# EAGLE design R&N Motor Controller (EAGLE 8.6.0)
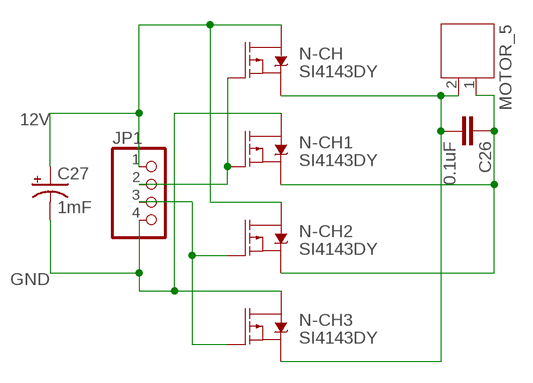
[diagram p0: schematic, sheet 1]

## Parts
C26  0.1uF  0.1UF-0603-25V-(+80/-20%)  [0603]
C27  1mF  1000UF-RADIAL-5MM-25V-20%  [CPOL-RADIAL-5MM-10MM]
JP1  PINHD-1X4  [1X04]
MOTOR_5  JST-PH2  [JST-PH2]
N-CH  SI4143DY  [SO-8]
N-CH1  SI4143DY  [SO-8]
N-CH2  SI4143DY  [SO-8]
N-CH3  SI4143DY  [SO-8]

## Nets
12V: C27.+ JP1.1 N-CH2.5(D) N-CH2.6(D) N-CH2.7(D) N-CH2.8(D) N-CH.5(D) N-CH.6(D) N-CH.7(D) N-CH.8(D)
GND: C27.- JP1.4 N-CH1.5(D) N-CH1.6(D) N-CH1.7(D) N-CH1.8(D) N-CH3.5(D) N-CH3.6(D) N-CH3.7(D) N-CH3.8(D)
N$9: C26.1 MOTOR_5.1 N-CH1.1(S) N-CH1.2(S) N-CH1.3(S) N-CH2.1(S) N-CH2.2(S) N-CH2.3(S)
N$10: C26.2 MOTOR_5.2 N-CH3.1(S) N-CH3.2(S) N-CH3.3(S) N-CH.1(S) N-CH.2(S) N-CH.3(S)
PWM_INA: JP1.2 N-CH1.4(G) N-CH.4(G)
PWM_INB: JP1.3 N-CH2.4(G) N-CH3.4(G)

## Library data of the parts
C26 = SparkFun-Capacitors:0.1UF: 0.1µF ceramic capacitors A capacitor is a passive two-terminal electrical component used to store electrical energy temporarily in an electric field.; PROD_ID: CAP-00810
C27 = SparkFun-Capacitors:1000UF: 1,000µF/1mF ceramic capacitors A capacitor is a passive two-terminal electrical component used to store electrical energy temporarily in an electric field. CAP-08070; PROD_ID: CAP-09538
JP1 = PinHead+:PINHD-1X4: PIN HEADER
MOTOR_5 = jst-ph:JST-PH2
N-CH N-CH1-N-CH3 = MOSFET:SI4143DY: MOSFET P-CHANNEL 30V 25.3A 8SO Digikey <https://www.digikey.com.au/product-detail/en/vishay-siliconix/SI4143DY-T1-GE3/SI4143DY-T1-GE3CT-ND/6834487>

## Board
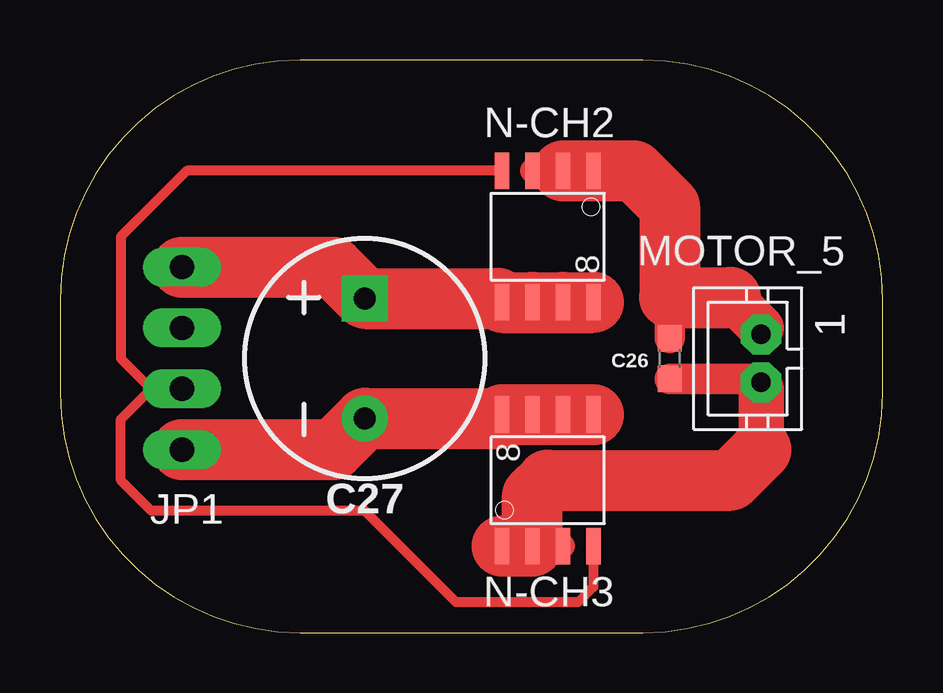
[diagram p1: board, top side]
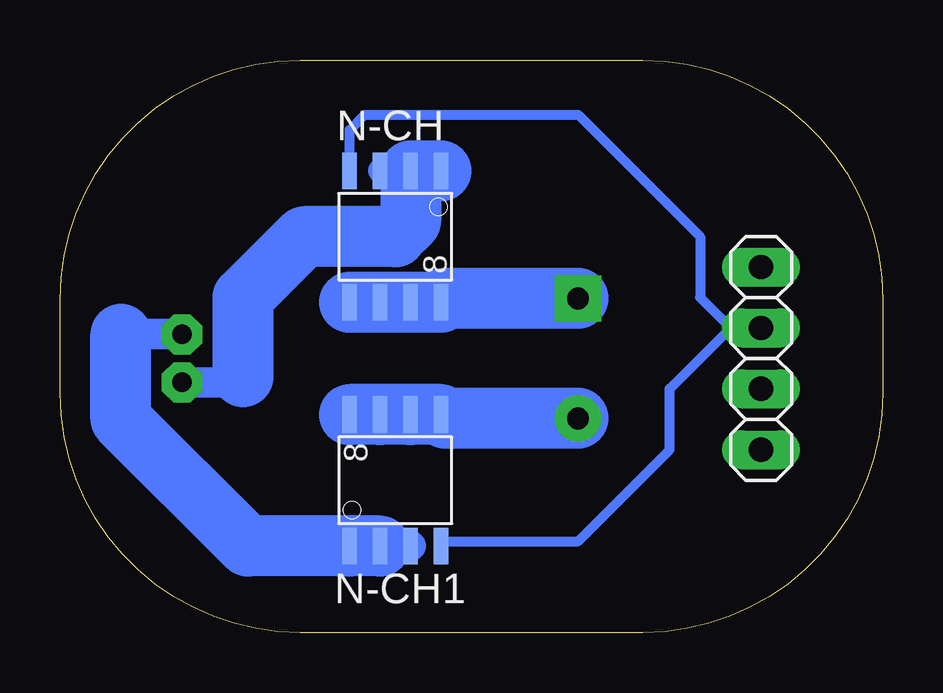
[diagram p2: board, bottom side, seen from below]

Size 34.29 x 23.88 mm. Coordinates in mm from the lower left corner, seen from the top.
Outline: 0,13.88 0,10 arc90 10,0 24.29,0 arc90 34.29,10 34.29,13.88 arc90 24.29,23.88 10,23.88 arc90 0,13.88
Copper layers (1*16): Top 0.035mm / dielectric 1.5mm / Bottom 0.035mm
Design rules "SparkFun": minimum track width 8mil, minimum drill 20mil, track to track 8mil, track to pad 8mil, pad to pad 8mil, via to via 8mil, smd to smd 8mil, copper to edge 10mil, drill to drill 8mil, minimum pad ring 12mil, minimum via ring 10mil, stop-mask expansion 4mil, vias tented up to drill 25mil, thermal gap 10mil

### Footprints (pad centres in the part's own frame; a part is rotated, then mirrored left to right if it is on the bottom)
0603 = smd 1.1 x 1: 1 -0.85,0; 2 0.85,0
CPOL-RADIAL-5MM-10MM = drill 0.9 pad 1.93 square: + 2.5,0 | drill 0.9 pad 1.93: - -2.5,0
1X04 = drill 1.016 long: 1 -3.81,0; 2 -1.27,0; 3 1.27,0; 4 3.81,0
JST-PH2 = drill 0.813 pad 1.676 octagon: 1 1,0; 2 -1,0
SO-8 = smd 1.524 x 0.61: 1 -2.743,1.905; 2 -2.743,0.635; 3 -2.743,-0.635; 4 -2.743,-1.905; 5 2.743,-1.905; 6 2.743,-0.635; 7 2.743,0.635; 8 2.743,1.905

### Placement (x,y rotation side)
C26  25.4,11.43 270 top
C27  12.7,11.43 90 top
JP1  5.08,11.43 270 bottom
MOTOR_5  29.21,11.43 90 top
N-CH  20.32,16.51 270 bottom
N-CH1  20.32,6.35 90 bottom
N-CH2  20.32,16.51 270 top
N-CH3  20.32,6.35 90 top

### Tracks (layer width: path | path; a pad name or v marks a point on that pad's centre or on a via)
12V
  Top 2.54: JP1.1 11.39,15.24 C27.+ 18.25,13.93 N-CH2.5 N-CH2.6 N-CH2.7 N-CH2.8
  Bottom 2.54: C27.+ 18.25,13.93 N-CH2.5 N-CH2.6 N-CH2.7 N-CH2.8
GND
  Top 2.54: N-CH1.8 N-CH1.7 N-CH1.6 N-CH1.5 18.25,8.93 C27.- 11.39,7.62 JP1.4
  Bottom 2.54: C27.- 18.25,8.93 N-CH1.5 N-CH1.6 N-CH1.7 N-CH1.8
N$9
  Top 1.016: N-CH2.3 N-CH2.2
  Top 1.27: 29.21,12.7 MOTOR_5.1 | 25.4,13.97 C26.1
  Top 1.905: 27.94,13.97 29.21,12.7
  Top 2.54: N-CH2.2 N-CH2.1 23.93,19.25 25.4,17.78 25.4,13.97 27.94,13.97
  Bottom 1.27: N-CH1.3 N-CH1.2 | 31.75,12.45 29.23,12.45 MOTOR_5.1
  Bottom 2.54: N-CH1.2 N-CH1.1 26.47,3.61 31.75,8.89 31.75,12.45
N$10
  Top 0.406: 29.21,8.89 arc-45 29.06,9.25 29.06,10.58
  Top 1.016: N-CH3.3 20.75,3.81 19.89,3.81 N-CH3.2
  Top 1.27: C26.2 29.06,10.58 MOTOR_5.2
  Top 1.905: 29.21,7.62 29.21,8.89 29.21,10.16
  Top 2.54: N-CH3.1 N-CH3.2 19.68,5.71 20.32,6.35 27.94,6.35 29.21,7.62
  Bottom 1.016: N-CH.3 N-CH.2
  Bottom 1.27: 26.67,10.67 26.91,10.43 MOTOR_5.2
  Bottom 2.54: N-CH.1 N-CH.2 19.68,17.14 20.32,16.51 24.13,16.51 26.67,13.97 26.67,10.67
PWM_INA
  Bottom 0.406: N-CH.4 22.23,20.95 21.59,21.59 12.7,21.59 7.62,16.51 7.62,13.97 6.35,12.7 | 6.35,12.7 JP1.2 | N-CH1.4 18.21,3.81 12.7,3.81 8.89,7.62 8.89,10.16 6.35,12.7
PWM_INB
  Top 0.406: N-CH2.4 5.28,19.25 2.54,16.51 2.54,11.43 3.81,10.16 | 3.81,10.16 JP1.3 | N-CH3.4 22.23,1.91 21.59,1.27 16.51,1.27 12.7,5.08 3.81,5.08 2.54,6.35 2.54,8.89 3.81,10.16